# EAGLE schematic CCM_0009 (EAGLE 9.0.1)

## Sheet 1 of 4: stage A
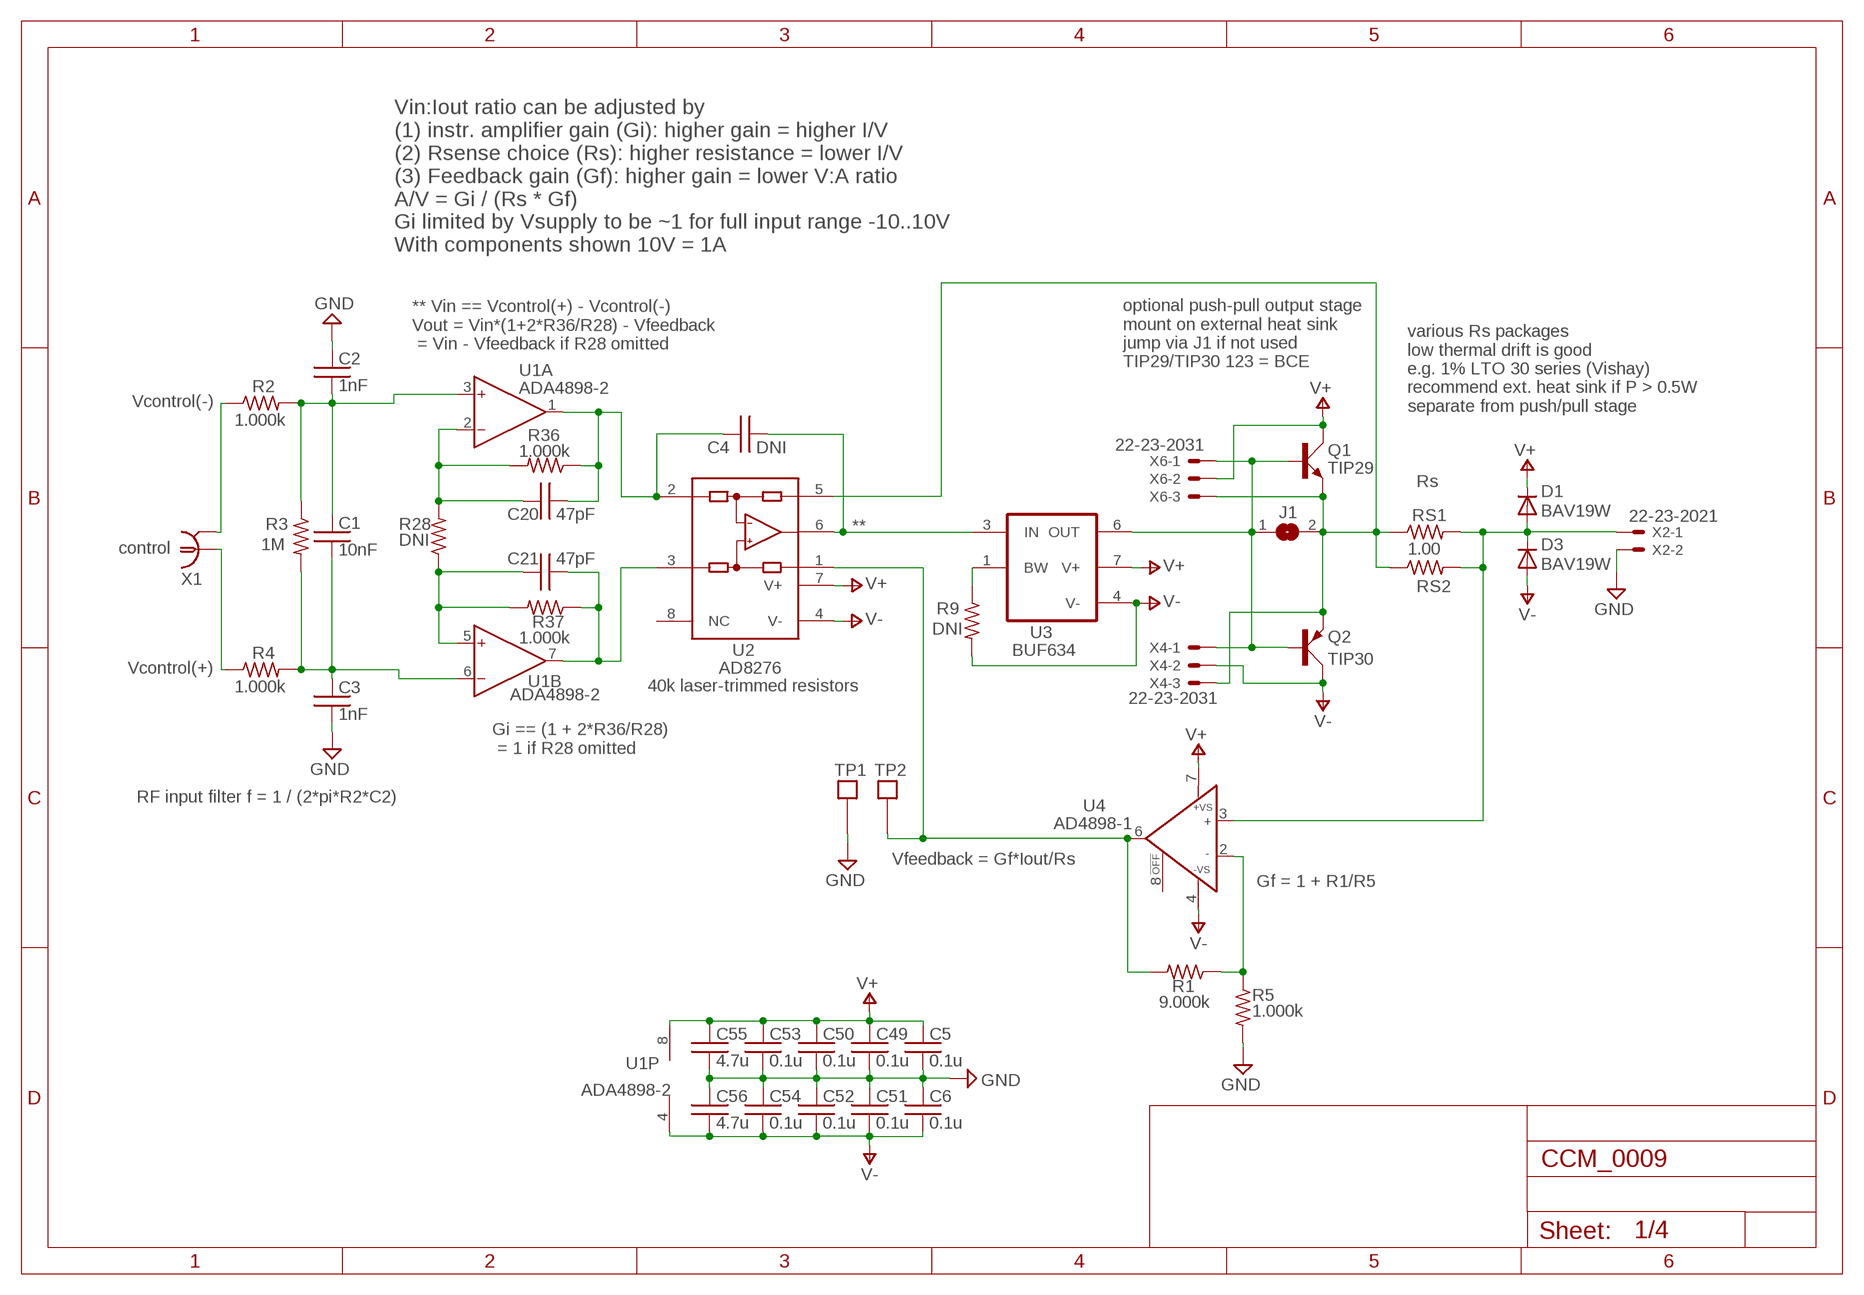
[diagram p0: schematic, sheet 1]

### Parts
C1  10nF  C0603  [0603]
C2  1nF  C0603  [0603]
C3  1nF  C0603  [0603]
C4  DNI  C0603  [0603]
C5  0.1u  C0603  [0603]
C6  0.1u  C0603  [0603]
C20  47pF  C0603  [0603]
C21  47pF  C0603  [0603]
C49  0.1u  C0603  [0603]
C50  0.1u  C0603  [0603]
C51  0.1u  C0603  [0603]
C52  0.1u  C0603  [0603]
C53  0.1u  C0603  [0603]
C54  0.1u  C0603  [0603]
C55  4.7u  C0603  [0603]
C56  4.7u  C0603  [0603]
D1  BAV19W  DIODE-SOD123  [SOD123]
D3  BAV19W  DIODE-SOD123  [SOD123]
J1  SJ  [SJ]
Q1  TIP29  TIP41C  [TO220AV]
Q2  TIP30  TIP42C  [TO220AV]
R1  9.000k  R0603  [0603]
R2  1.000k  R0603  [0603]
R3  1M  R0603  [0603]
R4  1.000k  R0603  [0603]
R5  1.000k  R0603  [0603]
R9  DNI  R0603  [0603]
R28  DNI  R0603  [0603]
R36  1.000k  R0603  [0603]
R37  1.000k  R0603  [0603]
RS1  1.00  LT030  [LTO30]
RS2  DNI  RESISTOR2512  [2512]
TP1  TESTPOINT  [TESTPOINT]
TP2  TESTPOINT  [TESTPOINT]
U1  ADA4898-2  ADA4898-2R  [SO8]
U2  AD8276  [SO8]
U3  BUF634  [SO8]
U4  AD4898-1  ADA4898-1R  [SO8]
X1  1-227161-0  [AMP_227161]
X2  22-23-2021  [22-23-2021]
X4  22-23-2031  [22-23-2031]
X6  22-23-2031  [22-23-2031]

### Nets
GND: C2.1 C3.2 C5.2 C6.1 C49.2 C50.2 C51.1 C52.1 C53.2 C54.1 C55.2 C56.1 R5.2 TP1.P$1 X2.2 ; also sheet 2,3,4
N$1: R2.1 X1.2
N$2: R4.1 X1.1
N$3: C4.2 U2.6(OUT) U3.3(IN)
N$5: C1.1 C2.2 R2.2 R3.1 U1.3(A:IN+)
N$6: C1.2 C3.1 R3.2 R4.2 U1.6(B:IN-)
N$7: R1.1 R5.1 U4.2(IN-)
N$9: J1.1 Q1.B Q2.B U3.6(OUT) X4.1 X6.1
N$11: D1.A D3.C RS1.P$2 RS2.2 U4.3(IN+) X2.1
N$12: J1.2 Q1.E Q2.E RS1.P$1 RS2.1 U2.5(SENSE) X4.3 X6.3
N$14: R9.1 U3.1(BW)
N$15: R1.2 TP2.P$1 U2.1(REF) U4.6(OUT)
N$26: C20.1 R28.2 R36.2 U1.2(A:IN-)
N$31: C21.1 R28.1 R37.2 U1.5(B:IN+)
N$33: C21.2 R37.1 U1.7(B:OUT) U2.3(+IN)
N$35: C4.1 C20.2 R36.1 U1.1(A:OUT) U2.2(-IN)
V+: C5.1 C49.1 C50.1 C53.1 C55.1 D1.C Q1.C U1.8(P:V+) U2.7(V+) U3.7(V+) U4.7(+VS) X6.2 ; also sheet 2,3,4
V-: C6.2 C51.2 C52.2 C54.2 C56.2 D3.A Q2.C R9.2 U1.4(P:V-) U2.4(V-) U3.4(V-) U4.4(-VS) X4.2 ; also sheet 2,3,4
Unconnected: U2.8(NC) U4.8(OFF)

### Notes on the sheet
- Vin:Iout ratio can be adjusted by 
  (1) instr. amplifier gain (Gi): higher gain = higher I/V
  (2) Rsense choice (Rs): higher resistance = lower I/V
  (3) Feedback gain (Gf): higher gain = lower V:A ratio
  A/V = Gi / (Rs * Gf)
  Gi limited by Vsupply to be ~1 for full input range -10..10V
  With components shown 10V = 1A
- ** Vin == Vcontrol(+) - Vcontrol(-)
  Vout = Vin*(1+2*R36/R28) - Vfeedback
   = Vin - Vfeedback if R28 omitted
- optional push-pull output stage
  mount on external heat sink
  jump via J1 if not used
  TIP29/TIP30 123 = BCE
- Vcontrol(-)
- various Rs packages
  low thermal drift is good
  e.g. 1% LTO 30 series (Vishay)
  recommend ext. heat sink if P > 0.5W
  separate from push/pull stage
- Rs
- **
- control
- Vcontrol(+)
- 40k laser-trimmed resistors
- Gi == (1 + 2*R36/R28)
   = 1 if R28 omitted
- RF input filter f = 1 / (2*pi*R2*C2)
- Vfeedback = Gf*Iout/Rs
- Gf = 1 + R1/R5

## Sheet 2 of 4: stage B
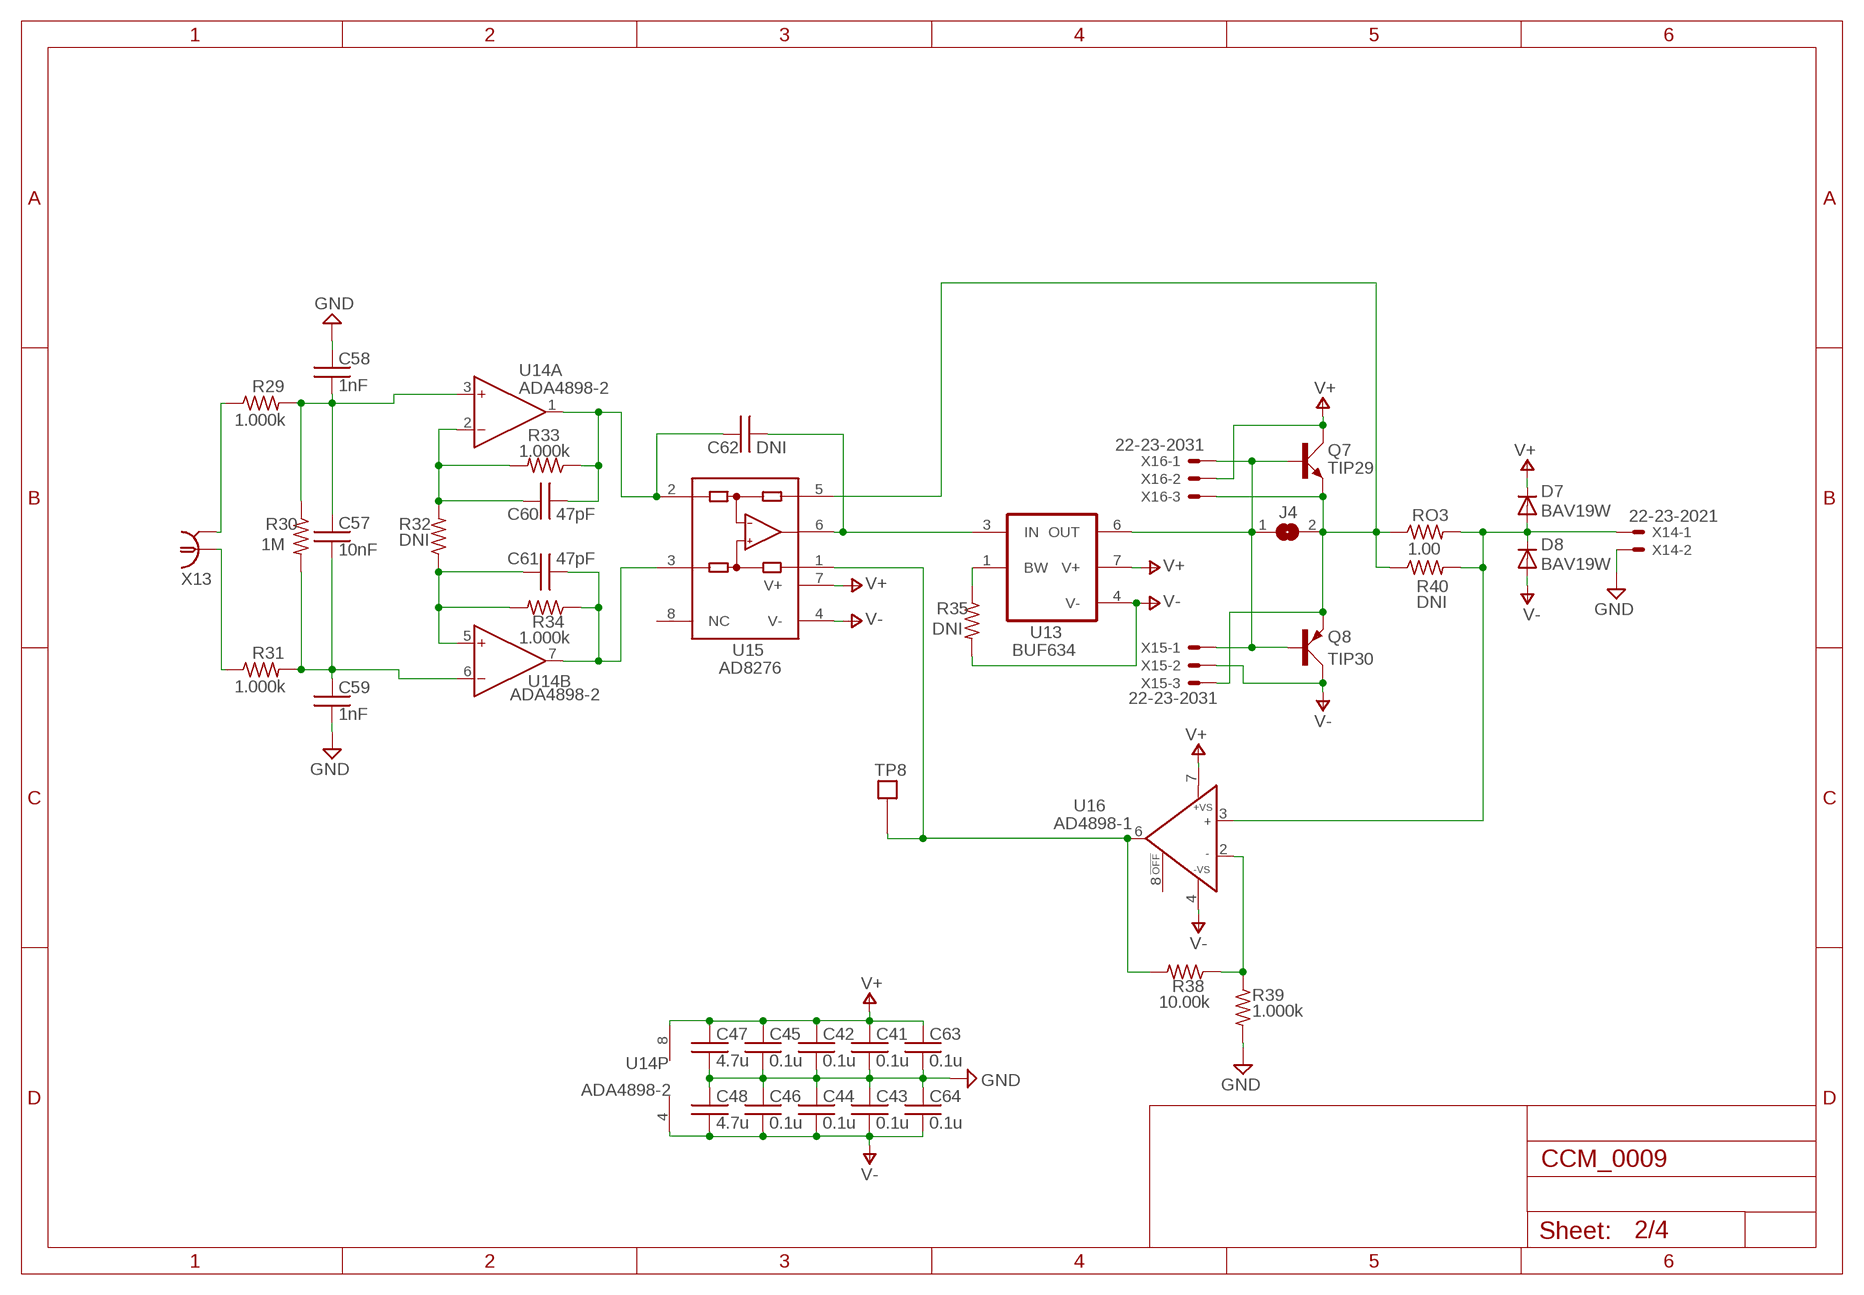
[diagram p1: schematic, sheet 2]

### Parts
C41  0.1u  C0603  [0603]
C42  0.1u  C0603  [0603]
C43  0.1u  C0603  [0603]
C44  0.1u  C0603  [0603]
C45  0.1u  C0603  [0603]
C46  0.1u  C0603  [0603]
C47  4.7u  C0603  [0603]
C48  4.7u  C0603  [0603]
C57  10nF  C0603  [0603]
C58  1nF  C0603  [0603]
C59  1nF  C0603  [0603]
C60  47pF  C0603  [0603]
C61  47pF  C0603  [0603]
C62  DNI  C0603  [0603]
C63  0.1u  C0603  [0603]
C64  0.1u  C0603  [0603]
D7  BAV19W  DIODE-SOD123  [SOD123]
D8  BAV19W  DIODE-SOD123  [SOD123]
J4  SJ  [SJ]
Q7  TIP29  TIP41C  [TO220AV]
Q8  TIP30  TIP42C  [TO220AV]
R29  1.000k  R0603  [0603]
R30  1M  R0603  [0603]
R31  1.000k  R0603  [0603]
R32  DNI  R0603  [0603]
R33  1.000k  R0603  [0603]
R34  1.000k  R0603  [0603]
R35  DNI  R0603  [0603]
R38  10.00k  R0603  [0603]
R39  1.000k  R0603  [0603]
R40  DNI  RESISTOR2512  [2512]
RO3  1.00  LT030  [LTO30]
TP8  TESTPOINT  [TESTPOINT]
U13  BUF634  [SO8]
U14  ADA4898-2  ADA4898-2R  [SO8]
U15  AD8276  [SO8]
U16  AD4898-1  ADA4898-1R  [SO8]
X13  1-227161-0  [AMP_227161]
X14  22-23-2021  [22-23-2021]
X15  22-23-2031  [22-23-2031]
X16  22-23-2031  [22-23-2031]

### Nets
GND: C41.2 C42.2 C43.1 C44.1 C45.2 C46.1 C47.2 C48.1 C58.1 C59.2 C63.2 C64.1 R39.2 X14.2 ; also sheet 1,3,4
N$46: C57.1 C58.2 R29.2 R30.1 U14.3(A:IN+)
N$47: C57.2 C59.1 R30.2 R31.2 U14.6(B:IN-)
N$48: R29.1 X13.2
N$49: R31.1 X13.1
N$50: C60.1 R32.2 R33.2 U14.2(A:IN-)
N$51: C61.1 R32.1 R34.2 U14.5(B:IN+)
N$52: C61.2 R34.1 U14.7(B:OUT) U15.3(+IN)
N$53: C60.2 C62.1 R33.1 U14.1(A:OUT) U15.2(-IN)
N$54: J4.1 Q7.B Q8.B U13.6(OUT) X15.1 X16.1
N$55: D7.A D8.C R40.2 RO3.P$2 U16.3(IN+) X14.1
N$56: R35.1 U13.1(BW)
N$57: C62.2 U13.3(IN) U15.6(OUT)
N$58: R38.2 TP8.P$1 U15.1(REF) U16.6(OUT)
N$59: J4.2 Q7.E Q8.E R40.1 RO3.P$1 U15.5(SENSE) X15.3 X16.3
N$60: R38.1 R39.1 U16.2(IN-)
V+: C41.1 C42.1 C45.1 C47.1 C63.1 D7.C Q7.C U13.7(V+) U14.8(P:V+) U15.7(V+) U16.7(+VS) X16.2 ; also sheet 1,3,4
V-: C43.2 C44.2 C46.2 C48.2 C64.2 D8.A Q8.C R35.2 U13.4(V-) U14.4(P:V-) U15.4(V-) U16.4(-VS) X15.2 ; also sheet 1,3,4
Unconnected: U15.8(NC) U16.8(OFF)

## Sheet 3 of 4: stage C
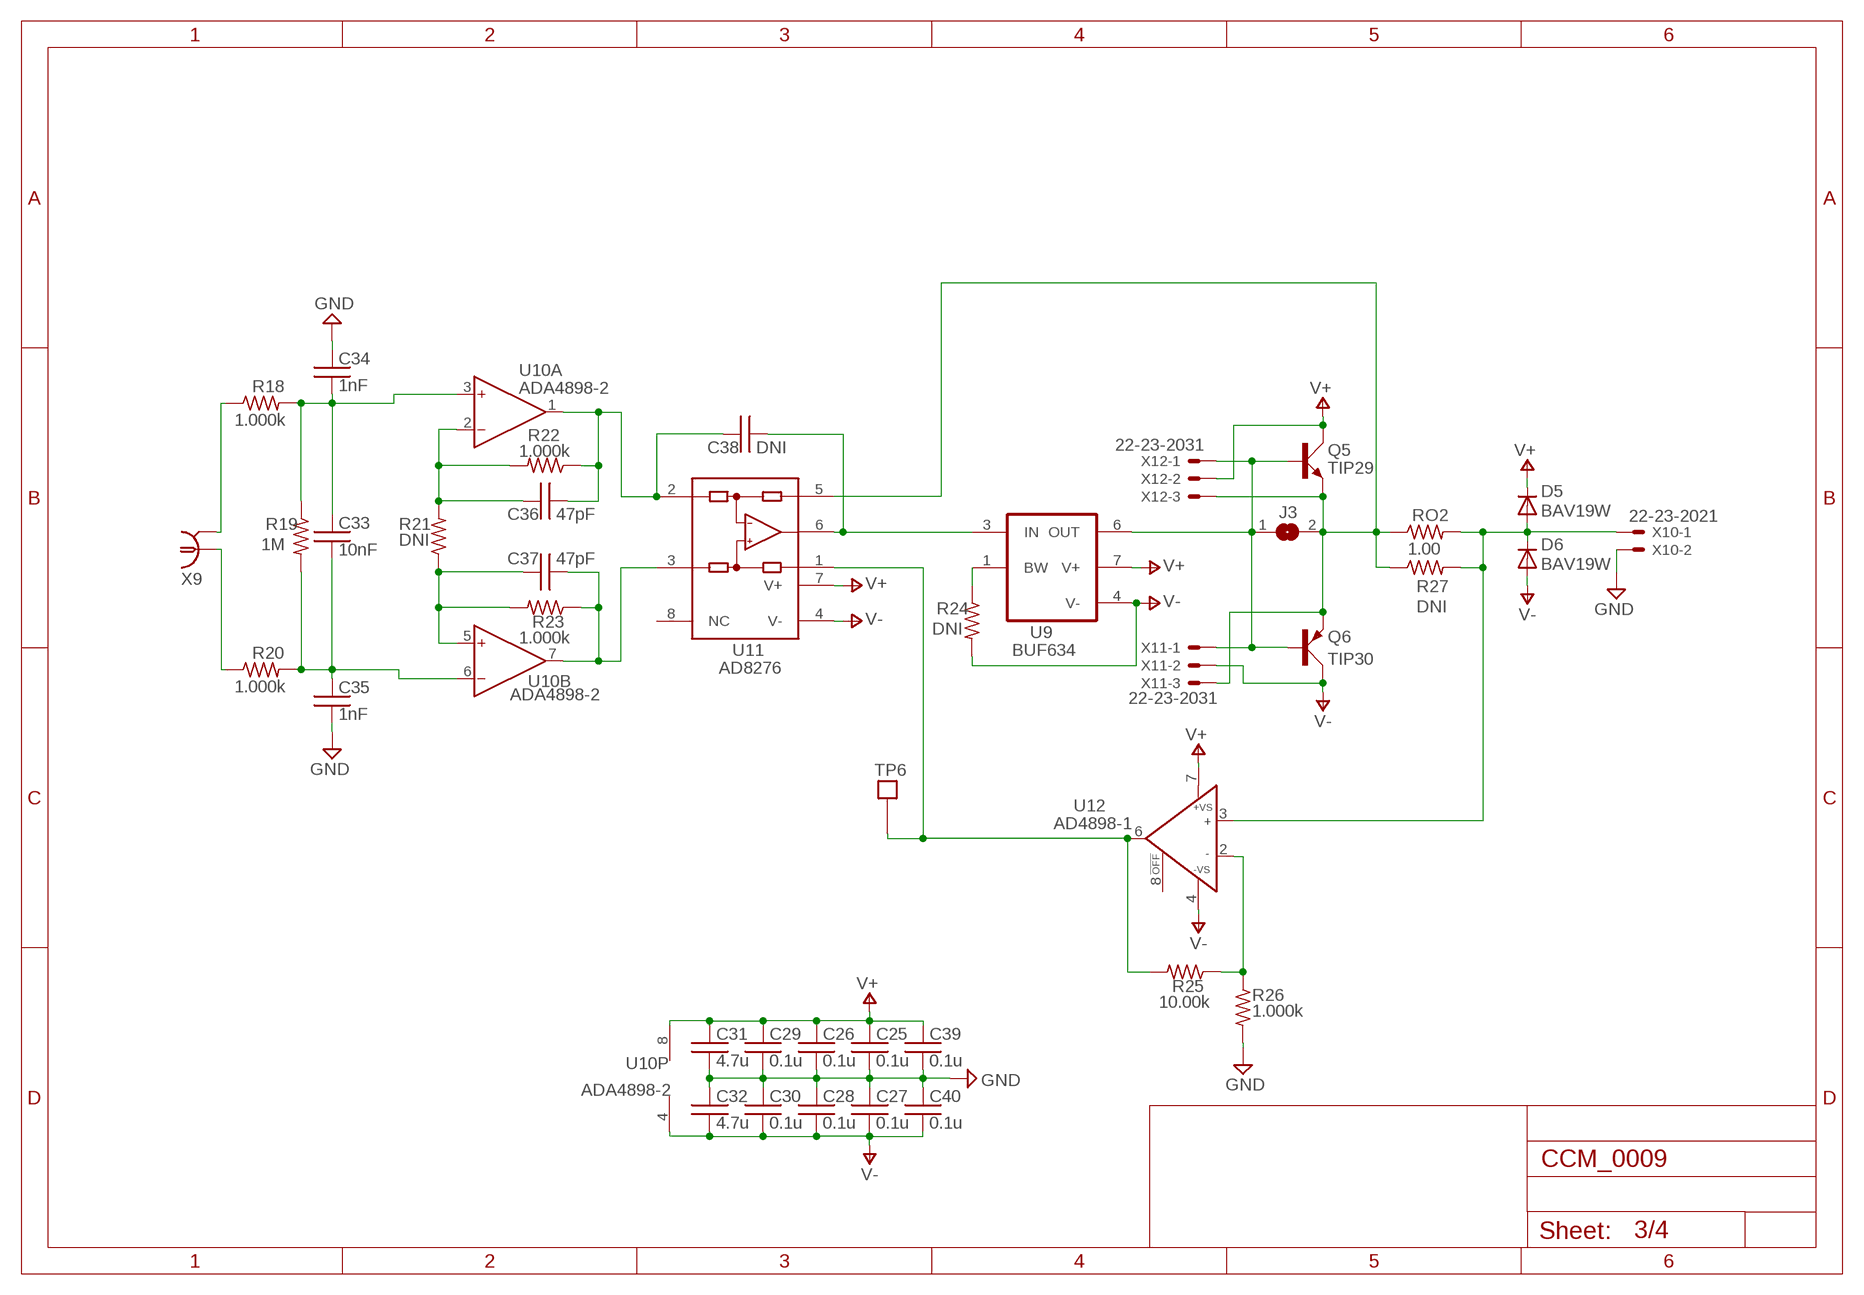
[diagram p2: schematic, sheet 3]

### Parts
C25  0.1u  C0603  [0603]
C26  0.1u  C0603  [0603]
C27  0.1u  C0603  [0603]
C28  0.1u  C0603  [0603]
C29  0.1u  C0603  [0603]
C30  0.1u  C0603  [0603]
C31  4.7u  C0603  [0603]
C32  4.7u  C0603  [0603]
C33  10nF  C0603  [0603]
C34  1nF  C0603  [0603]
C35  1nF  C0603  [0603]
C36  47pF  C0603  [0603]
C37  47pF  C0603  [0603]
C38  DNI  C0603  [0603]
C39  0.1u  C0603  [0603]
C40  0.1u  C0603  [0603]
D5  BAV19W  DIODE-SOD123  [SOD123]
D6  BAV19W  DIODE-SOD123  [SOD123]
J3  SJ  [SJ]
Q5  TIP29  TIP41C  [TO220AV]
Q6  TIP30  TIP42C  [TO220AV]
R18  1.000k  R0603  [0603]
R19  1M  R0603  [0603]
R20  1.000k  R0603  [0603]
R21  DNI  R0603  [0603]
R22  1.000k  R0603  [0603]
R23  1.000k  R0603  [0603]
R24  DNI  R0603  [0603]
R25  10.00k  R0603  [0603]
R26  1.000k  R0603  [0603]
R27  DNI  RESISTOR2512  [2512]
RO2  1.00  LT030  [LTO30]
TP6  TESTPOINT  [TESTPOINT]
U9  BUF634  [SO8]
U10  ADA4898-2  ADA4898-2R  [SO8]
U11  AD8276  [SO8]
U12  AD4898-1  ADA4898-1R  [SO8]
X9  1-227161-0  [AMP_227161]
X10  22-23-2021  [22-23-2021]
X11  22-23-2031  [22-23-2031]
X12  22-23-2031  [22-23-2031]

### Nets
GND: C25.2 C26.2 C27.1 C28.1 C29.2 C30.1 C31.2 C32.1 C34.1 C35.2 C39.2 C40.1 R26.2 X10.2 ; also sheet 1,2,4
N$28: C33.1 C34.2 R18.2 R19.1 U10.3(A:IN+)
N$29: C33.2 C35.1 R19.2 R20.2 U10.6(B:IN-)
N$30: R18.1 X9.2
N$32: R20.1 X9.1
N$34: C36.1 R21.2 R22.2 U10.2(A:IN-)
N$36: C37.1 R21.1 R23.2 U10.5(B:IN+)
N$37: C37.2 R23.1 U10.7(B:OUT) U11.3(+IN)
N$38: C36.2 C38.1 R22.1 U10.1(A:OUT) U11.2(-IN)
N$39: J3.1 Q5.B Q6.B U9.6(OUT) X11.1 X12.1
N$40: D5.A D6.C R27.2 RO2.P$2 U12.3(IN+) X10.1
N$41: R24.1 U9.1(BW)
N$42: C38.2 U9.3(IN) U11.6(OUT)
N$43: R25.2 TP6.P$1 U11.1(REF) U12.6(OUT)
N$44: J3.2 Q5.E Q6.E R27.1 RO2.P$1 U11.5(SENSE) X11.3 X12.3
N$45: R25.1 R26.1 U12.2(IN-)
V+: C25.1 C26.1 C29.1 C31.1 C39.1 D5.C Q5.C U9.7(V+) U10.8(P:V+) U11.7(V+) U12.7(+VS) X12.2 ; also sheet 1,2,4
V-: C27.2 C28.2 C30.2 C32.2 C40.2 D6.A Q6.C R24.2 U9.4(V-) U10.4(P:V-) U11.4(V-) U12.4(-VS) X11.2 ; also sheet 1,2,4
Unconnected: U11.8(NC) U12.8(OFF)

## Sheet 4 of 4: power
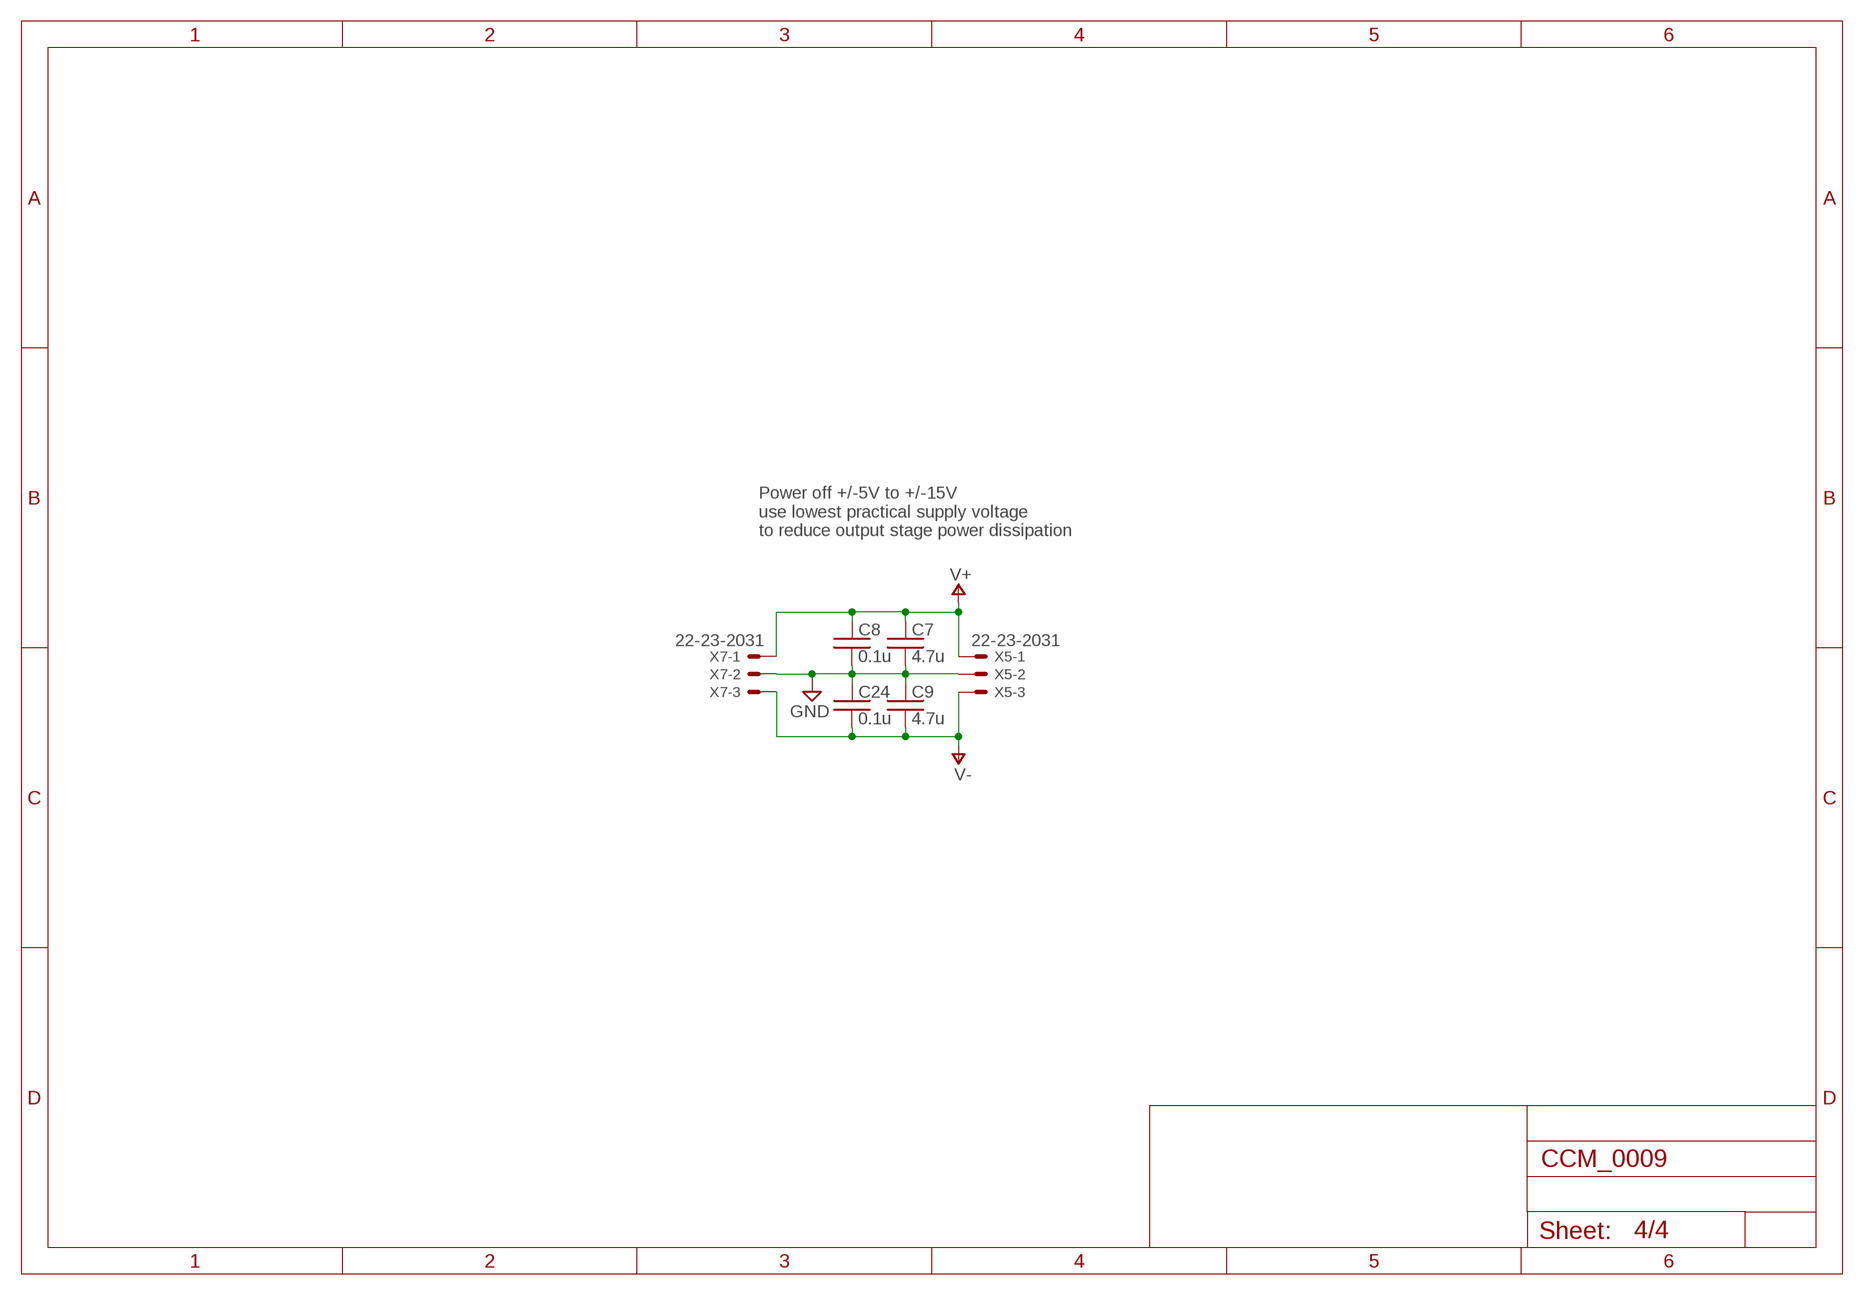
[diagram p3: schematic, sheet 4]

### Parts
C7  4.7u  C0603  [0603]
C8  0.1u  C0603  [0603]
C9  4.7u  C0603  [0603]
C24  0.1u  C0603  [0603]
X5  22-23-2031  [22-23-2031]
X7  22-23-2031  [22-23-2031]

### Nets
GND: C7.2 C8.2 C9.1 C24.1 X5.2 X7.2 ; also sheet 1,2,3
V+: C7.1 C8.1 X5.1 X7.1 ; also sheet 1,2,3
V-: C9.2 C24.2 X5.3 X7.3 ; also sheet 1,2,3

### Notes on the sheet
- Power off +/-5V to +/-15V
  use lowest practical supply voltage 
  to reduce output stage power dissipation

## Library data of the parts
C1-C9 C20 C21 C24-C64 = acrooptics:C: Capacitor
D1 D3 D5-D8 = AquariumLibrary:DIODE-: DIODE
J1 J3 J4 = acrooptics:SJ: SMD solder JUMPER
Q1 Q5 Q7 = transistor-power:TIP41C: NPN TRANSISTOR
Q2 Q6 Q8 = transistor-power:TIP42C: PNP TRANSISTOR
R1-R5 R9 R18-R26 R28-R39 = acrooptics:R: 0603 resistor
R27 R40 RS2 = noah:RESISTOR: RESISTOR, American symbol
RO2 RO3 RS1 = noah:LT030
TP1 TP2 TP6 TP8 = Fitch:TESTPOINT
U1 U10 U14 = noah:ADA4898-2: General-Purpose CMOS Rail-to-Rail Amplifiers Source: http://www.analog.com/static/imported-files/data_sheets/AD8541_8542_8544.pdf; MF: ALTERA CORPORATION; MPN: AD8542ARZ-REEL; OC_FARNELL: 1424150; OC_NEWARK: 59K6827
U2 U11 U15 = noah:AD8276: Precision Unity Gain Diff. Amplifier
U3 U9 U13 = noah:BUF634: 250mA High-Speed Buffer
U4 U12 U16 = noah:ADA4898-1; MF: ANALOG DEVICES; MPN: AD744JR; OC_FARNELL: 1651300; OC_NEWARK: 05F7341
X1 X9 X13 = con-coax:?227161*: JACK, RIGHT ANGLE, 50 OHM, PCB, BNC Source: amp_227161.pdf; MF: TYCO ELECTRONICS; MPN: 1-227161; OC_FARNELL: unknown; OC_NEWARK: 33B3200
X2 X10 X14 = con-molex:22-23-2021: .100" (2.54mm) Center Header - 2 Pin; MF: MOLEX; MPN: 22-23-2021; OC_FARNELL: 1462926; OC_NEWARK: 25C3832
X4-X7 X11 X12 X15 X16 = con-molex:22-23-2031: .100" (2.54mm) Center Header - 3 Pin; MF: MOLEX; MPN: 22-23-2031; OC_FARNELL: 1462950; OC_NEWARK: 30C0862

## Net classes
1 standard: width 0.61 mm, clearance 0.254 mm